# EAGLE schematic encorder (EAGLE 9.6.1)
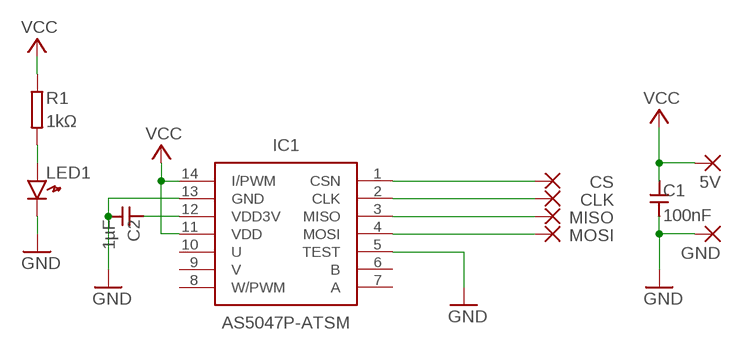
[diagram p0: schematic, sheet 1]

## Parts
5V  SMD2  [SMD1,27-2,54]
C1  100nF  CAPACITOR1608  [SMD1608]
C2  1µF  CAPACITOR1608  [SMD1608]
CLK  SMD2  [SMD1,27-2,54]
CS  SMD2  [SMD1,27-2,54]
GND  SMD2  [SMD1,27-2,54]
IC1  AS5047P-ATSM  [SOP65P640X120-14N]
LED1  LED1608  [LED1608]
MISO  SMD2  [SMD1,27-2,54]
MOSI  SMD2  [SMD1,27-2,54]
R1  1kΩ  RESISTOR1608  [SMD1608]

## Nets
GND: C1.2 C2.2 GND.1(P) IC1.5(TEST) IC1.13(GND) LED1.K
N$1: C2.1 IC1.12(VDD3V)
N$2: CS.1(P) IC1.1(CSN)
N$3: CLK.1(P) IC1.2(CLK)
N$4: IC1.3(MISO) MISO.1(P)
N$5: IC1.4(MOSI) MOSI.1(P)
N$6: LED1.A R1.2
VCC: 5V.1(P) C1.1 IC1.11(VDD) IC1.14(I/PWM) R1.1
Unconnected: IC1.6(B) IC1.7(A) IC1.8(W/PWM) IC1.9(V) IC1.10(U)

## Library data of the parts
5V CLK CS GND MISO MOSI = wirepad:SMD2: SMD PAD
C1 C2 = generic:CAPACITOR: Generic Capacitor
IC1 = rcssl_lib:AS5047P-ATSM: Board Mount Hall Effect / Magnetic Sensors 14 bit core res Up to 28krpm <https://componentsearchengine.com/Images/1/AS5047P-ATSM.jpg> Source: Datasheet <http://ams.com/eng/content/download/725051/1853902/379375>; DESCRIPTION: Board Mount Hall Effect / Magnetic Sensors 14 bit core res Up to 28krpm; HEIGHT: 1.2mm; MANUFACTURER_NAME: ams; MANUFACTURER_PART_NUMBER: AS5047P-ATSM; SUPPLIER_NAME: RS
LED1 = generic:LED: Generic LEDs
R1 = generic:RESISTOR: Generic Registor